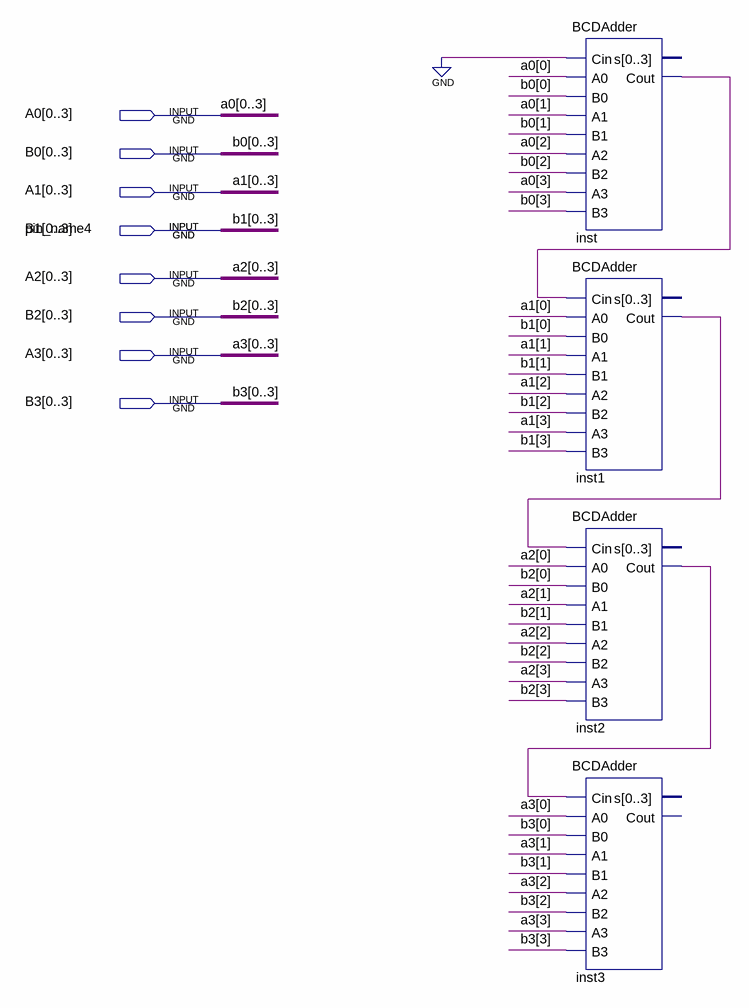
[diagram p0: schematic sheet]
// Quartus schematic 4digitBCDAdder.bdf as structural Verilog: 4 symbols, 9 pins
module \4digitBCDAdder  (
  input  [0:3] A0,
  input  [0:3] B0,
  input  [0:3] A1,
  input  pin_name4,
  input  [0:3] B1,
  input  [0:3] A2,
  input  [0:3] B2,
  input  [0:3] A3,
  input  [0:3] B3
);

  wire inst1_cout, inst2_cout, inst_cout;

  BCDAdder inst (
    .Cin(1'b0), .A0(A0[0]), .B0(B0[0]), .A1(A0[1]), .B1(B0[1]), .A2(A0[2]), .B2(B0[2]), .A3(A0[3]),
    .B3(B0[3]), .Cout(inst_cout));  // open: s
  BCDAdder inst1 (
    .Cin(inst_cout), .A0(A1[0]), .B0(B1[0]), .A1(A1[1]), .B1(B1[1]), .A2(A1[2]), .B2(B1[2]), .A3(A1[3]),
    .B3(B1[3]), .Cout(inst1_cout));  // open: s
  BCDAdder inst2 (
    .Cin(inst1_cout), .A0(A2[0]), .B0(B2[0]), .A1(A2[1]), .B1(B2[1]), .A2(A2[2]), .B2(B2[2]), .A3(A2[3]),
    .B3(B2[3]), .Cout(inst2_cout));  // open: s
  BCDAdder inst3 (
    .Cin(inst2_cout), .A0(A3[0]), .B0(B3[0]), .A1(A3[1]), .B1(B3[1]), .A2(A3[2]), .B2(B3[2]), .A3(A3[3]),
    .B3(B3[3]));  // open: s, Cout
endmodule
